# EAGLE design PQ60 Radio FV1 (EAGLE 7.4.0)
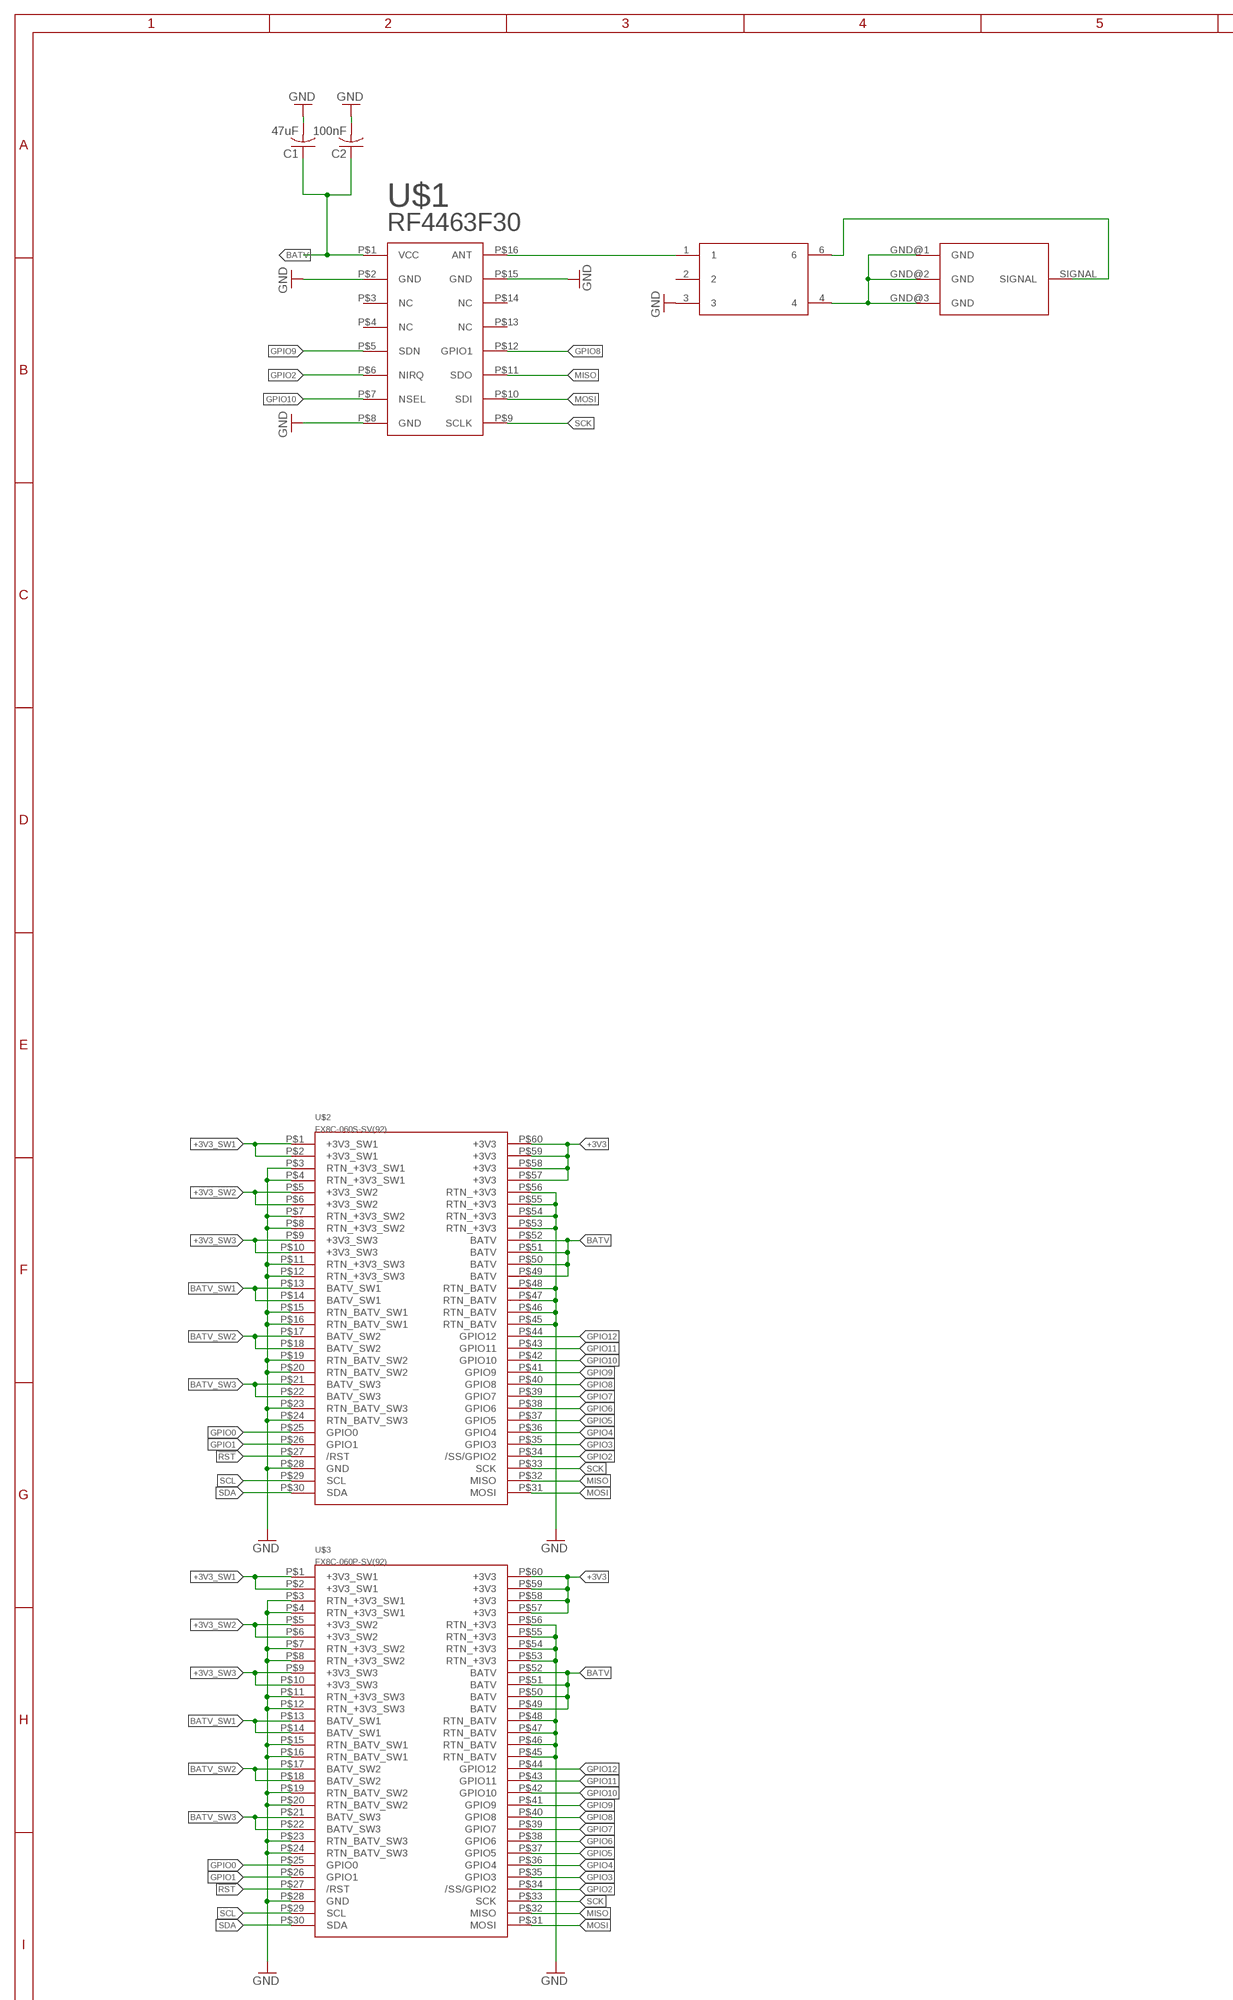
[diagram p0: schematic, sheet 1, part 1 of 2]
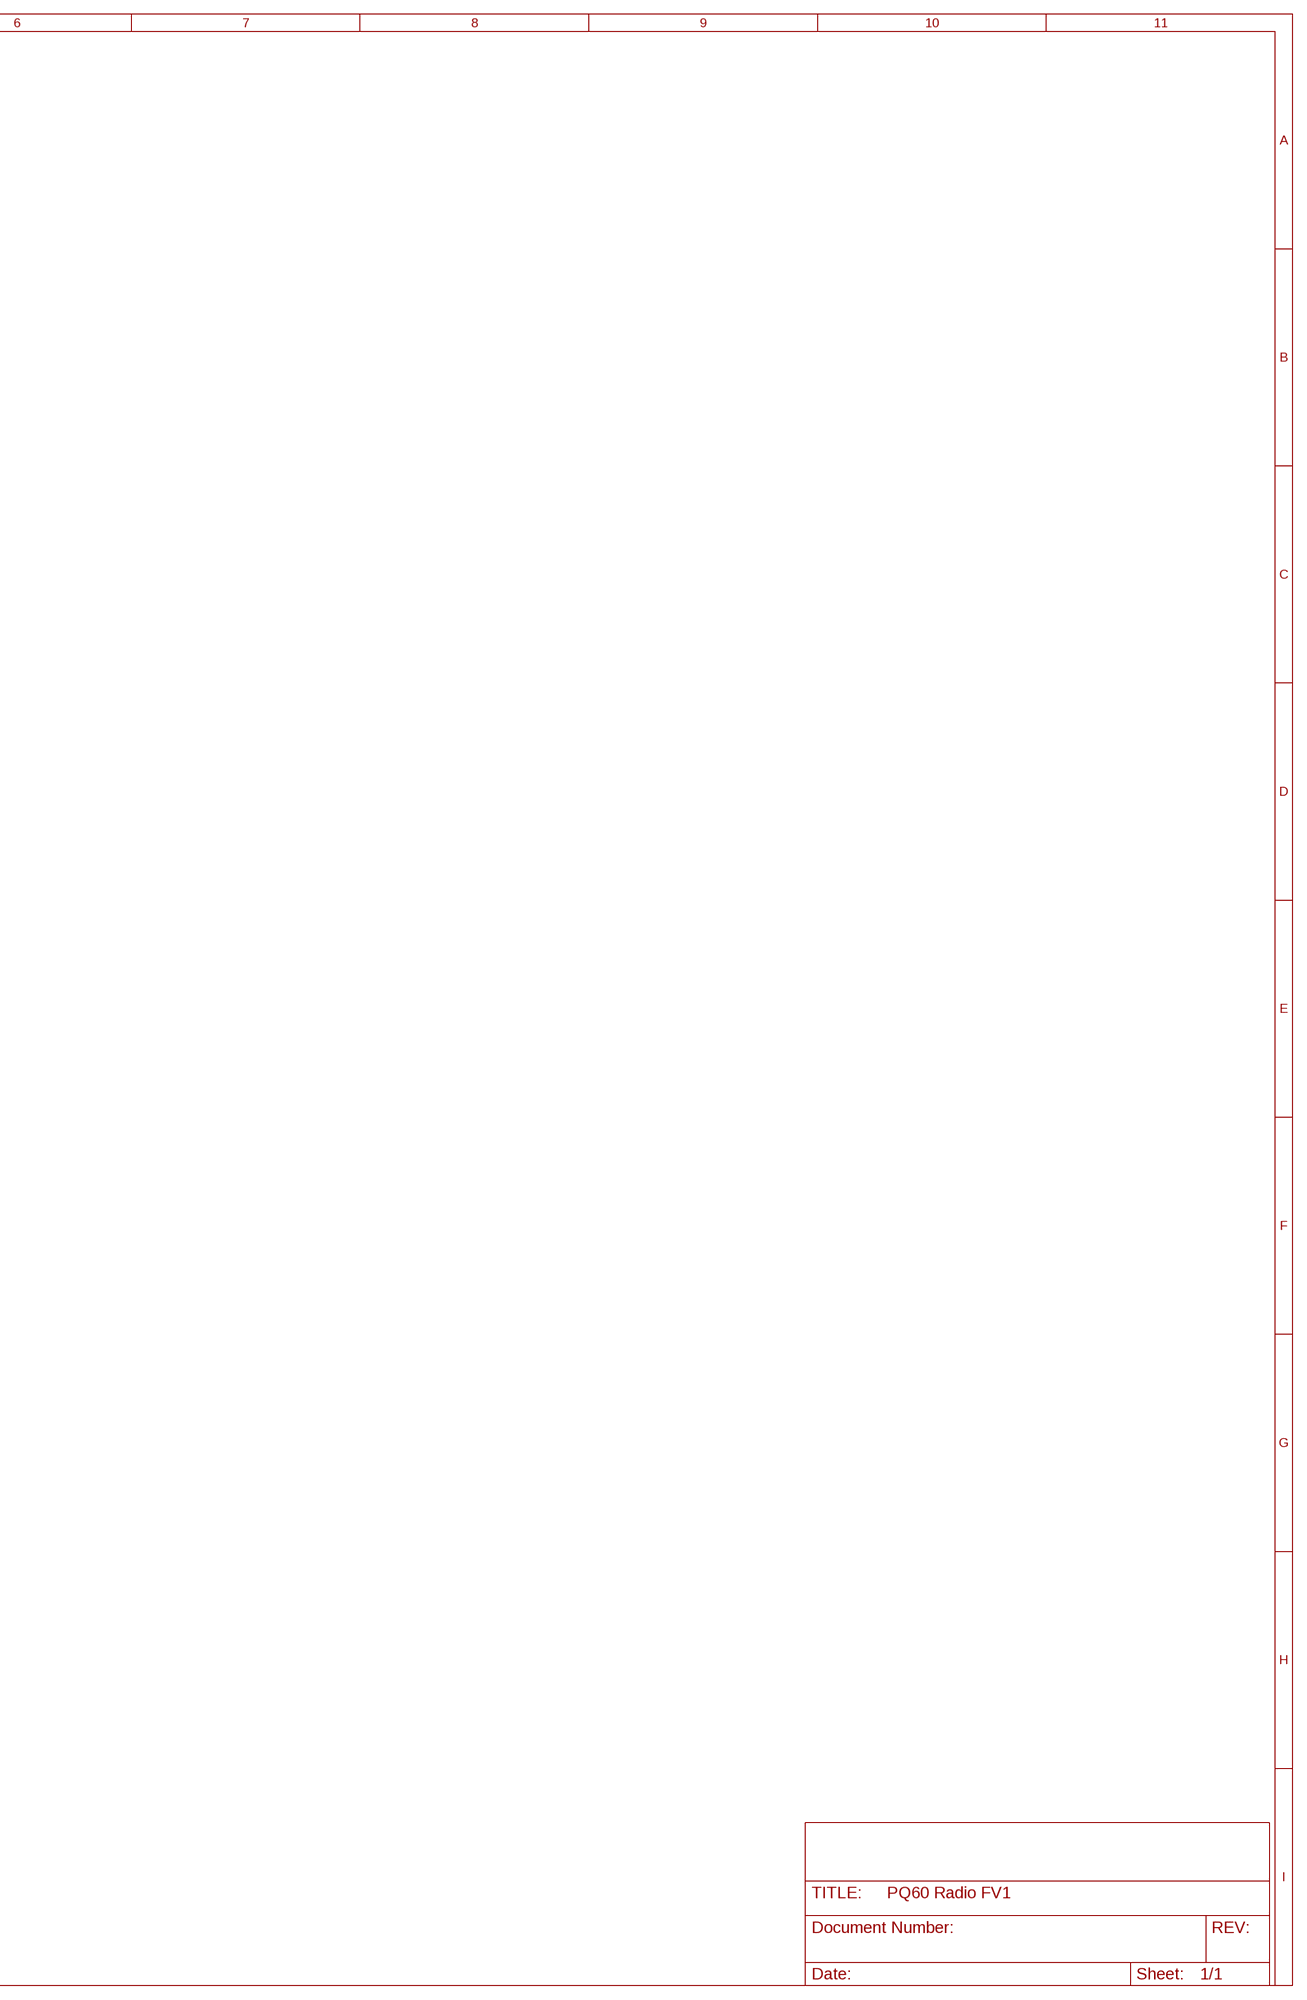
[diagram p1: schematic, sheet 1, part 2 of 2]

## Parts
C1  47uF  C-USC0805  [C0805]
C2  100nF  C-USC0805  [C0805]
CX2156NL  CX2156NL  [CX2156NL]
U$1  RF4463F30  [RF4463F30]
U$2  FX8C-060S-SV(92)  [FX8C-060S-SV(92)]
U$3  FX8C-060P-SV(92)  [FX8C-060P-SV(92)]
U$4  MICRO-SMA  [MICRO-SMA]

## Nets
!RST: U$2.P$27(/RST) U$3.P$27(/RST)
+3V3: U$2.P$57(+3V3) U$2.P$58(+3V3) U$2.P$59(+3V3) U$2.P$60(+3V3) U$3.P$57(+3V3) U$3.P$58(+3V3) U$3.P$59(+3V3) U$3.P$60(+3V3)
+3V3_SW1: U$2.P$1(+3V3_SW1) U$2.P$2(+3V3_SW1) U$3.P$1(+3V3_SW1) U$3.P$2(+3V3_SW1)
+3V3_SW2: U$2.P$5(+3V3_SW2) U$2.P$6(+3V3_SW2) U$3.P$5(+3V3_SW2) U$3.P$6(+3V3_SW2)
+3V3_SW3: U$2.P$9(+3V3_SW3) U$2.P$10(+3V3_SW3) U$3.P$9(+3V3_SW3) U$3.P$10(+3V3_SW3)
BATV: C1.1 C2.1 U$1.P$1(VCC) U$2.P$49(BATV) U$2.P$50(BATV) U$2.P$51(BATV) U$2.P$52(BATV) U$3.P$49(BATV) U$3.P$50(BATV) U$3.P$51(BATV) U$3.P$52(BATV)
BATV_SW1: U$2.P$13(BATV_SW1) U$2.P$14(BATV_SW1) U$3.P$13(BATV_SW1) U$3.P$14(BATV_SW1)
BATV_SW2: U$2.P$17(BATV_SW2) U$2.P$18(BATV_SW2) U$3.P$17(BATV_SW2) U$3.P$18(BATV_SW2)
BATV_SW3: U$2.P$21(BATV_SW3) U$2.P$22(BATV_SW3) U$3.P$21(BATV_SW3) U$3.P$22(BATV_SW3)
GND: C1.2 C2.2 CX2156NL.3 U$1.P$2(GND) U$1.P$8(GND) U$1.P$15(GND) U$2.P$3(RTN_+3V3_SW1) U$2.P$4(RTN_+3V3_SW1) U$2.P$7(RTN_+3V3_SW2) U$2.P$8(RTN_+3V3_SW2) U$2.P$11(RTN_+3V3_SW3) U$2.P$12(RTN_+3V3_SW3) U$2.P$15(RTN_BATV_SW1) U$2.P$16(RTN_BATV_SW1) U$2.P$19(RTN_BATV_SW2) U$2.P$20(RTN_BATV_SW2) U$2.P$23(RTN_BATV_SW3) U$2.P$24(RTN_BATV_SW3) U$2.P$28(GND) U$2.P$45(RTN_BATV) U$2.P$46(RTN_BATV) U$2.P$47(RTN_BATV) U$2.P$48(RTN_BATV) U$2.P$53(RTN_+3V3) U$2.P$54(RTN_+3V3) U$2.P$55(RTN_+3V3) U$2.P$56(RTN_+3V3) U$3.P$3(RTN_+3V3_SW1) U$3.P$4(RTN_+3V3_SW1) U$3.P$7(RTN_+3V3_SW2) U$3.P$8(RTN_+3V3_SW2) U$3.P$11(RTN_+3V3_SW3) U$3.P$12(RTN_+3V3_SW3) U$3.P$15(RTN_BATV_SW1) U$3.P$16(RTN_BATV_SW1) U$3.P$19(RTN_BATV_SW2) U$3.P$20(RTN_BATV_SW2) U$3.P$23(RTN_BATV_SW3) U$3.P$24(RTN_BATV_SW3) U$3.P$28(GND) U$3.P$45(RTN_BATV) U$3.P$46(RTN_BATV) U$3.P$47(RTN_BATV) U$3.P$48(RTN_BATV) U$3.P$53(RTN_+3V3) U$3.P$54(RTN_+3V3) U$3.P$55(RTN_+3V3) U$3.P$56(RTN_+3V3)
GPIO0: U$2.P$25(GPIO0) U$3.P$25(GPIO0)
GPIO1: U$2.P$26(GPIO1) U$3.P$26(GPIO1)
GPIO2: U$1.P$6(NIRQ) U$2.P$34(/SS/GPIO2) U$3.P$34(/SS/GPIO2)
GPIO3: U$2.P$35(GPIO3) U$3.P$35(GPIO3)
GPIO4: U$2.P$36(GPIO4) U$3.P$36(GPIO4)
GPIO5: U$2.P$37(GPIO5) U$3.P$37(GPIO5)
GPIO6: U$2.P$38(GPIO6) U$3.P$38(GPIO6)
GPIO7: U$2.P$39(GPIO7) U$3.P$39(GPIO7)
GPIO8: U$1.P$12(GPIO1) U$2.P$40(GPIO8) U$3.P$40(GPIO8)
GPIO9: U$1.P$5(SDN) U$2.P$41(GPIO9) U$3.P$41(GPIO9)
GPIO10: U$1.P$7(NSEL) U$2.P$42(GPIO10) U$3.P$42(GPIO10)
GPIO11: U$2.P$43(GPIO11) U$3.P$43(GPIO11)
GPIO12: U$2.P$44(GPIO12) U$3.P$44(GPIO12)
MISO: U$1.P$11(SDO) U$2.P$32(MISO) U$3.P$32(MISO)
MOSI: U$1.P$10(SDI) U$2.P$31(MOSI) U$3.P$31(MOSI)
N$1: CX2156NL.1 U$1.P$16(ANT)
N$2: CX2156NL.6 U$4.SIGNAL
N$3: CX2156NL.4 U$4.GND@1(GND) U$4.GND@2(GND) U$4.GND@3(GND)
SCK: U$1.P$9(SCLK) U$2.P$33(SCK) U$3.P$33(SCK)
SCL: U$2.P$29(SCL) U$3.P$29(SCL)
SDA: U$2.P$30(SDA) U$3.P$30(SDA)
Unconnected: CX2156NL.2 U$1.P$3(NC) U$1.P$4(NC) U$1.P$13(NC) U$1.P$14(NC)

## Library data of the parts
C1 C2 = adafruit:C-US: CAPACITOR, American symbol
CX2156NL = CX2156NL:CX2156NL
U$1 = Radio EV1:RF4463F30: Radio
U$2 = PQ60:FX8C-060S-SV(92)
U$3 = PQ60:FX8C-060P-SV(92)
U$4 = Micro-sma:MICRO-SMA

## Net classes
0 default: clearance 0.205 mm

## Board
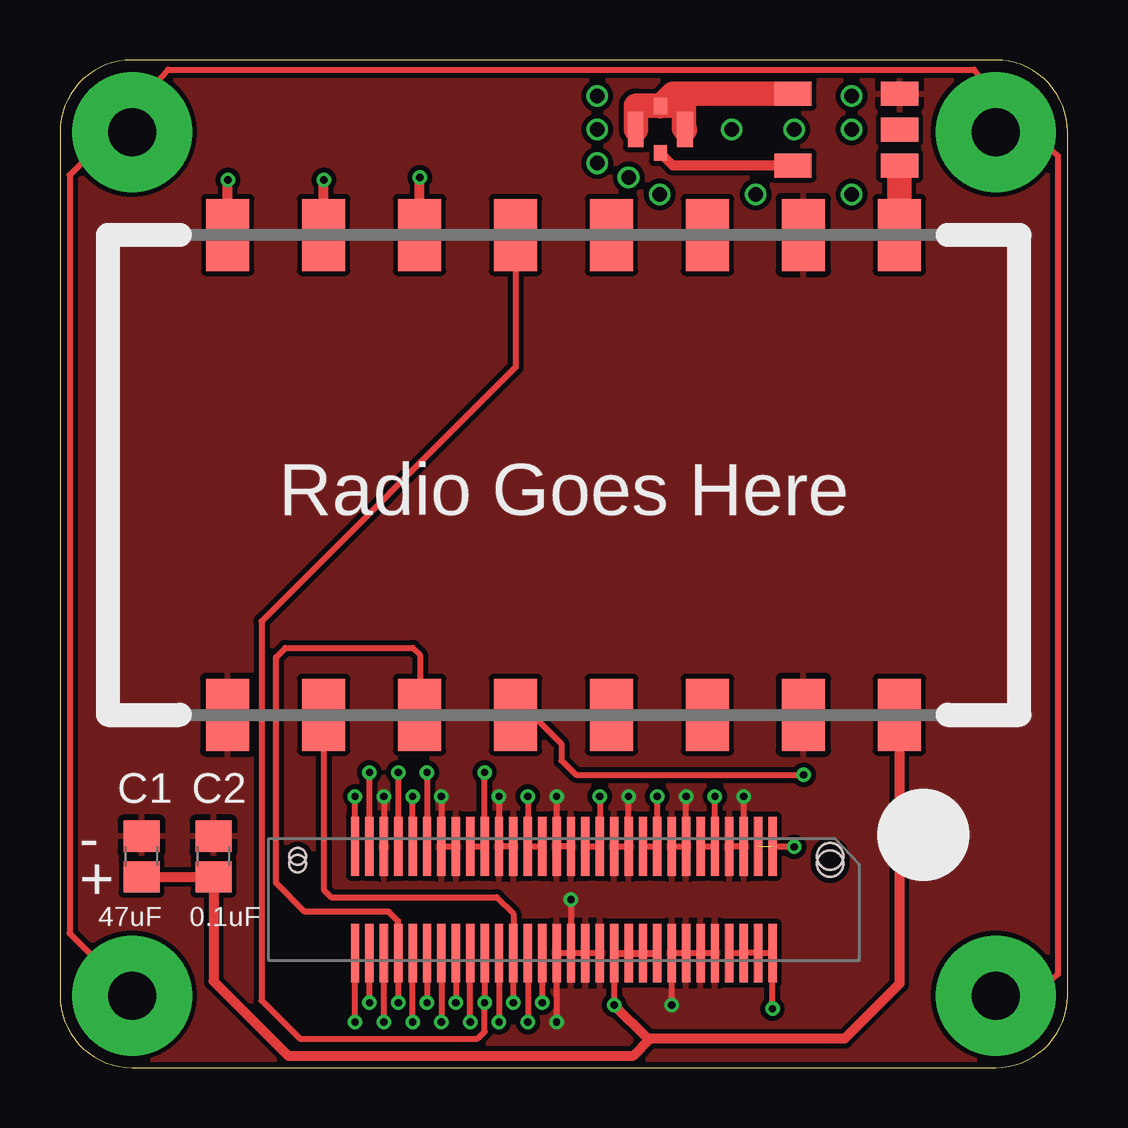
[diagram p2: board, top side]
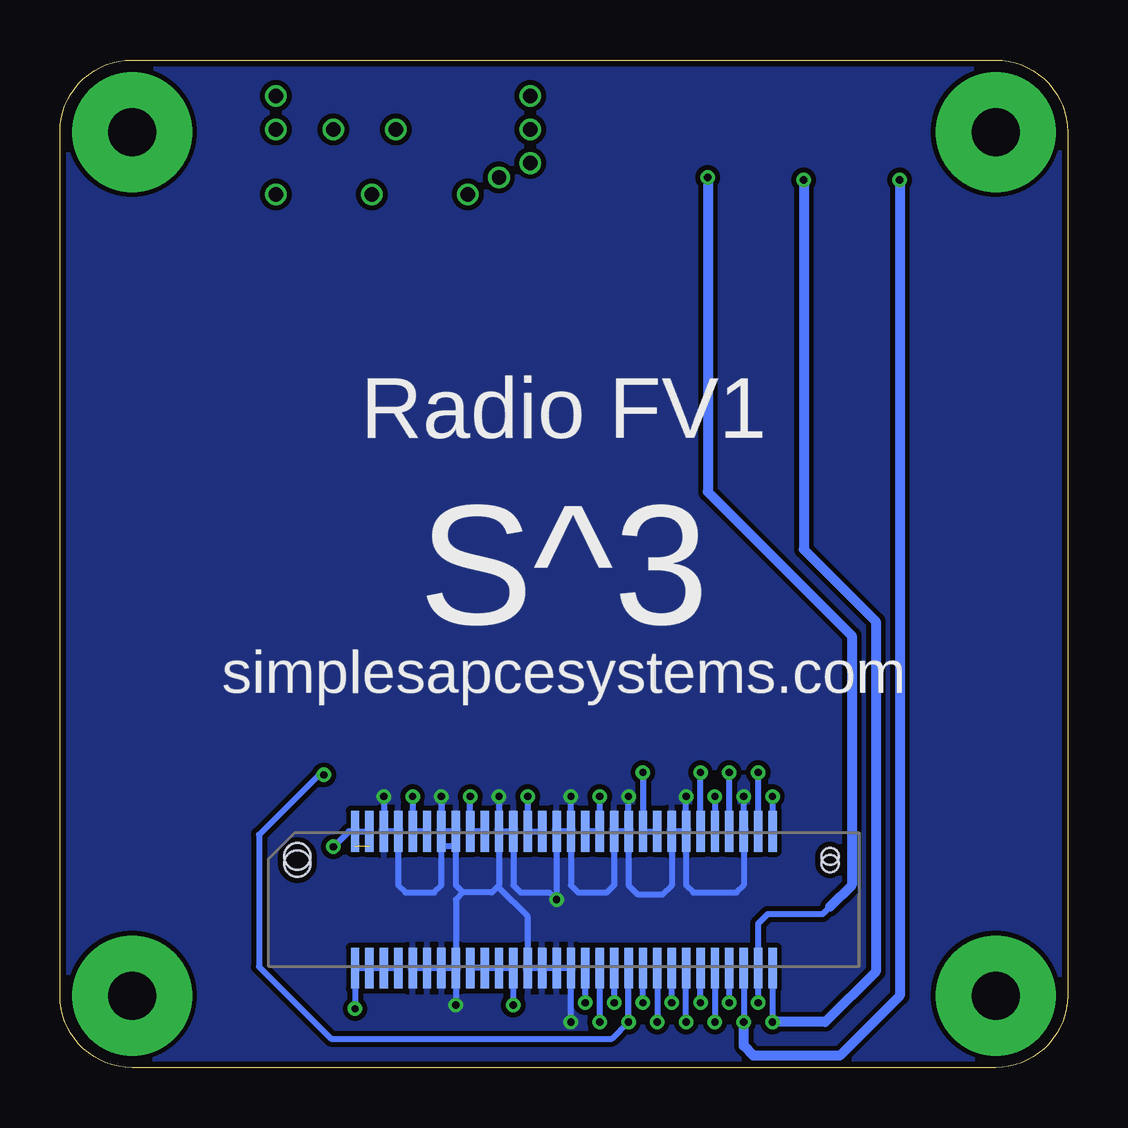
[diagram p3: board, bottom side, seen from below]

Size 42 x 42 mm. Coordinates in mm from the lower left corner, seen from the top.
Outline: 42,3 42,39 arc90 39,42 3,42 arc90 0,39 0,3 arc90 3,0 39,0 arc90 42,3
Copper layers (1*16): Top 0.035mm / dielectric 1.5mm / Bottom 0.035mm
Design rules "SeeedStudio_2layer_DRU_no_angle_20140221": minimum track width 6mil, minimum drill 12mil, track to track 6mil, track to pad 6mil, pad to pad 6mil, via to via 6mil, smd to smd 0mil, copper to edge 10mil, drill to drill 10mil, minimum pad ring 10mil, minimum via ring 6mil, stop-mask expansion 2mil, vias tented up to drill 100mil, thermal gap 10mil

### Footprints (pad centres in the part's own frame; a part is rotated, then mirrored left to right if it is on the bottom)
C0805 = smd 1.3 x 1.5: 1 -0.85,0; 2 0.85,0
CX2156NL = smd 1 x 1.55: 1 0,0; 2 1.5,0; 3 3,0; 4 3,4.45; 6 0,4.45
RF4463F30 = smd 1.8 x 3: P$1 33,-20; P$2 29,-20; P$3 25,-20; P$4 21,-20; P$5 17,-20; P$6 13,-20; P$7 9,-20; P$8 5,-20; P$9 5,0; P$10 9,0; P$11 13,0; P$12 17,0; P$13 21,0; P$14 25,0; P$15 29,0; P$16 33,0
FX8C-060S-SV(92) = smd 0.35 x 1.7: P$1 -8.7,2.85; P$2 -8.1,2.85; P$3 -7.5,2.85; P$4 -6.9,2.85; P$5 -6.3,2.85; P$6 -5.7,2.85; P$7 -5.1,2.85; P$8 -4.5,2.85; P$9 -3.9,2.85; P$10 -3.3,2.85; P$11 -2.7,2.85; P$12 -2.1,2.85; P$13 -1.5,2.85; P$14 -0.9,2.85; P$15 -0.3,2.85; P$16 0.3,2.85; P$17 0.9,2.85; P$18 1.5,2.85; P$19 2.1,2.85; P$20 2.7,2.85; P$21 3.3,2.85; P$22 3.9,2.85; P$23 4.5,2.85; P$24 5.1,2.85; P$25 5.7,2.85; P$26 6.3,2.85; P$27 6.9,2.85; P$28 7.5,2.85; P$29 8.1,2.85; P$30 8.7,2.85; P$31 8.7,-2.85; P$32 8.1,-2.85; P$33 7.5,-2.85; P$34 6.9,-2.85; P$35 6.3,-2.85; P$36 5.7,-2.85; P$37 5.1,-2.85; P$38 4.5,-2.85; P$39 3.9,-2.85; P$40 3.3,-2.85; P$41 2.7,-2.85; P$42 2.1,-2.85; P$43 1.5,-2.85; P$44 0.9,-2.85; P$45 0.3,-2.85; P$46 -0.3,-2.85; P$47 -0.9,-2.85; P$48 -1.5,-2.85; P$49 -2.1,-2.85; P$50 -2.7,-2.85; P$51 -3.3,-2.85; P$52 -3.9,-2.85; P$53 -4.5,-2.85; P$54 -5.1,-2.85; P$55 -5.7,-2.85; P$56 -6.3,-2.85; P$57 -6.9,-2.85; P$58 -7.5,-2.85; P$59 -8.1,-2.85; P$60 -8.7,-2.85 | hole 1.1: -11.1,1.8 | hole 0.7: 11.1,1.8
FX8C-060P-SV(92) = smd 0.35 x 2.45: P$1 -8.7,-2.225; P$2 -8.1,-2.225; P$3 -7.5,-2.225; P$4 -6.9,-2.225; P$5 -6.3,-2.225; P$6 -5.7,-2.225; P$7 -5.1,-2.225; P$8 -4.5,-2.225; P$9 -3.9,-2.225; P$10 -3.3,-2.225; P$11 -2.7,-2.225; P$12 -2.1,-2.225; P$13 -1.5,-2.225; P$14 -0.9,-2.225; P$15 -0.3,-2.225; P$16 0.3,-2.225; P$17 0.9,-2.225; P$18 1.5,-2.225; P$19 2.1,-2.225; P$20 2.7,-2.225; P$21 3.3,-2.225; P$22 3.9,-2.225; P$23 4.5,-2.225; P$24 5.1,-2.225; P$25 5.7,-2.225; P$26 6.3,-2.225; P$27 6.9,-2.225; P$28 7.5,-2.225; P$29 8.1,-2.225; P$30 8.7,-2.225; P$31 8.7,2.225; P$32 8.1,2.225; P$33 7.5,2.225; P$34 6.9,2.225; P$35 6.3,2.225; P$36 5.7,2.225; P$37 5.1,2.225; P$38 4.5,2.225; P$39 3.9,2.225; P$40 3.3,2.225; P$41 2.7,2.225; P$42 2.1,2.225; P$43 1.5,2.225; P$44 0.9,2.225; P$45 0.3,2.225; P$46 -0.3,2.225; P$47 -0.9,2.225; P$48 -1.5,2.225; P$49 -2.1,2.225; P$50 -2.7,2.225; P$51 -3.3,2.225; P$52 -3.9,2.225; P$53 -4.5,2.225; P$54 -5.1,2.225; P$55 -5.7,2.225; P$56 -6.3,2.225; P$57 -6.9,2.225; P$58 -7.5,2.225; P$59 -8.1,2.225; P$60 -8.7,2.225 | hole 1.1: -11.1,-1.5 | hole 0.7: 11.1,-1.5
MICRO-SMA = smd 0.65 x 1.45: GND@1 0,0; GND@3 2.05,0 | smd 0.55 x 0.65: GND@2 1.025,0.975; SIGNAL 1.025,-0.975

### Placement (x,y rotation side)
C1  3.4,8.8 90 top
C2  6.4,8.8 90 top
CX2156NL  35,37.6 90 top
U$1  1.99,34.7 0 top
U$2  21,7 0 bottom
U$3  21,7 180 top
U$4  24,39.1 0 top

### Tracks (layer width: path | path; a pad name or v marks a point on that pad's centre or on a via)
!RST  (via drill 0.3)
  Top 0.254: v14.1,12.3 U$3.P$27
  Bottom 0.254: U$2.P$27 v14.1,12.3
+3V3  (via drill 0.3)
  Top 0.254: U$3.P$57 U$3.P$58 U$3.P$59 U$3.P$60 v29.7,2.45
  Bottom 0.254: U$2.P$60 U$2.P$59 U$2.P$58 U$2.P$57 | U$2.P$60 U$3.P$60 | U$2.P$60 v29.7,2.45
+3V3_SW1  (via drill 0.3)  (1 unrouted)
  Top 0.254: v30.6,9.2 29.73,9.2 U$3.P$1
  Bottom 0.254: U$2.P$2 U$2.P$1 29.95,9.85 v30.6,9.2
+3V3_SW2  (via drill 0.3)
  Top 0.254: U$3.P$6 U$3.P$5 v27.3,11.3
  Bottom 0.254: U$2.P$6 U$2.P$5 v27.3,11.3
+3V3_SW3  (via drill 0.3)
  Top 0.254: U$3.P$10 U$3.P$9 v24.9,11.3
  Bottom 0.254: U$2.P$10 U$2.P$9 | 24.9,9.1 U$2.P$9 | U$2.P$9 v24.9,11.3
BATV  (via drill 0.3)
  Top 0.254: U$3.P$49 U$3.P$50 U$3.P$51 U$3.P$52 24.85,4.72 23.1,4.72 v23.1,2.6
  Top 0.406: C1.1 C2.1 6.4,3.6 9.5,0.5 23.9,0.5 24.6,1.2 | U$1.P$1 34.99,3.49 32.7,1.2 24.6,1.2 | 24.6,1.2 24.5,1.2 v23.1,2.6
  Bottom 0.254: U$2.P$52 U$2.P$51 U$2.P$50 U$2.P$49 | v23.1,2.6 U$2.P$49 | 23.1,4.7 U$2.P$49
BATV_SW1  (via drill 0.3)
  Top 0.254: U$3.P$14 U$3.P$13 v22.5,11.3
  Bottom 0.254: U$2.P$14 U$2.P$13 v22.5,11.3
BATV_SW2  (via drill 0.3)
  Top 0.254: U$3.P$17 U$3.P$18 v19.5,11.3
  Bottom 0.254: U$2.P$17 U$2.P$18 v19.5,11.3
BATV_SW3  (via drill 0.3)
  Top 0.254: U$3.P$22 U$3.P$21 v17.7,12.3
  Bottom 0.254: U$2.P$22 U$2.P$21 v17.7,12.3
CHASSIS_GND  (via drill 2 pad 5)
  Top 0.254: v3,3 0.4,5.6 0.4,37.2 2.2,39 v3,39 3,40 4.5,41.6 38.1,41.6 39,40.6 v39,39 40.5,39 41.6,38 41.6,3.9 40.6,3 v39,3
GND  (via drill 0.3)
  Top 0.254: U$3.P$46 U$3.P$45 v20.7,1.9 | U$3.P$46 U$3.P$47 U$3.P$48 | U$3.P$56 U$3.P$55 U$3.P$54 U$3.P$53 v25.5,2.6 | v21.3,7 U$3.P$46 | v13.5,11.3 U$3.P$28 | U$3.P$23 U$3.P$24 v15.9,11.3 | U$3.P$19 U$3.P$20 v18.3,11.3 | U$3.P$15 U$3.P$16 v20.7,11.3 | U$3.P$12 U$3.P$11 v23.7,11.3 | U$3.P$8 U$3.P$7 v26.1,11.3 | U$3.P$4 U$3.P$3 v28.5,11.3
  Bottom 0.254: U$2.P$56 U$2.P$55 U$2.P$54 U$2.P$53 | v20.7,1.9 U$2.P$45 U$2.P$46 U$2.P$47 U$2.P$48 22.5,6.3 23.7,7.5 23.7,7.6 | U$2.P$53 v25.5,2.6 | U$2.P$24 15.9,7.6 15.6,7.3 13.8,7.3 13.5,7.6 U$2.P$28 v13.5,11.3 | U$2.P$24 U$2.P$23 16.5,7.6 16.9,7.2 17.9,7.2 18.3,7.6 U$2.P$20 | U$2.P$20 U$2.P$19 18.9,7.6 19.2,7.3 20.4,7.3 20.7,7.6 U$2.P$16 | U$2.P$16 U$2.P$15 v21.3,7 21.6,7.3 22.8,7.3 23.1,7.6 U$2.P$12 U$2.P$11 v23.7,11.3 | U$2.P$24 v15.9,11.3 | U$2.P$20 v18.3,11.3 | U$2.P$16 v20.7,11.3 | U$2.P$8 U$2.P$7 v26.1,11.3 U$3.P$7 | 23.7,9.2 23.7,7.6 | 23.7,7.6 24,7.3 25.2,7.3 | 25.2,7.3 25.5,7.6 U$3.P$8 U$3.P$7 | 25.2,7.3 25.5,7 U$2.P$53 | U$3.P$7 26.1,7.6 26.4,7.3 27.6,7.3 27.9,7.6 U$2.P$4 U$2.P$3 v28.5,11.3
  pour Bottom: 33.8,42 3.2,42 arc90 0,38.8 0,3.2 arc90 3.2,0 38.8,0 arc90 42.1,3.3 42.1,38.7 arc90 38.8,42 35.6,42
  pour Top: 34.1,42 3.3,42 arc90 0,38.7 0,3.3 arc90 3.3,0 38.8,0 arc90 42,3.2 42,39 arc90 39,42 34.6,42
GPIO0  (via drill 0.3)
  Top 0.254: v15.3,12.3 U$3.P$25
  Bottom 0.254: U$2.P$25 v15.3,12.3
GPIO1  (via drill 0.3)
  Top 0.254: U$3.P$26 v14.7,11.3
  Bottom 0.254: v14.7,11.3 U$2.P$26
GPIO2  (via drill 0.3)
  Top 0.254: v14.1,2.7 U$3.P$34 14.1,6.1 13.7,6.5 10.2,6.5 9,7.7 9,17.1 9.4,17.5 14.7,17.5 15,17.2 U$1.P$6
  Bottom 0.254: v14.1,2.7 U$2.P$34
GPIO3  (via drill 0.3)
  Top 0.254: v14.7,1.9 U$3.P$35
  Bottom 0.254: U$2.P$35 v14.7,1.9
GPIO4  (via drill 0.3)
  Top 0.254: U$3.P$36 v15.3,2.7
  Bottom 0.254: v15.3,2.7 U$2.P$36
GPIO5  (via drill 0.3)
  Top 0.254: U$3.P$37 v15.9,1.9
  Bottom 0.254: v15.9,1.9 U$2.P$37 | U$2.P$37 15.9,4.7 15.85,4.75 15.85,4.2 U$2.P$37
GPIO6  (via drill 0.3)
  Top 0.254: U$3.P$38 v16.5,2.7
  Bottom 0.254: v16.5,2.7 U$2.P$38
GPIO7  (via drill 0.3)
  Top 0.254: v17.1,1.9 U$3.P$39
  Bottom 0.254: U$2.P$39 v17.1,1.9
GPIO8  (via drill 0.3)
  Top 0.254: U$3.P$40 v17.7,2.7 17.7,1.5 17.4,1.2 10,1.2 8.4,2.8 8.4,18.6 18.99,29.19 U$1.P$12
  Bottom 0.254: v17.7,2.7 U$2.P$40 | U$2.P$40 17.7,4.8 17.65,4.85 17.65,4.2 U$2.P$40
GPIO9  (via drill 0.3)
  Top 0.254: U$3.P$41 v18.3,1.9 | U$1.P$5 19.7,14.7 20.9,13.5 20.9,12.8 21.5,12.2 v31,12.2
  Bottom 0.254: U$2.P$41 v18.3,1.9 19,1.2 30.7,1.2 33.7,4.2 33.7,9.7 31.2,12.2 v31,12.2
GPIO10  (via drill 0.3)
  Top 0.254: v18.9,2.7 U$3.P$42 18.9,6.4 18.2,7.1 11.3,7.1 10.99,7.41 U$1.P$7
  Bottom 0.254: U$2.P$42 v18.9,2.7
GPIO11  (via drill 0.3)
  Top 0.254: U$3.P$43 v19.5,1.9
  Bottom 0.254: v19.5,1.9 U$2.P$43
GPIO12  (via drill 0.3)
  Top 0.254: U$3.P$44 v20.1,2.7
  Bottom 0.254: v20.1,2.7 U$2.P$44
MISO  (via drill 0.3)
  Top 0.254: v12.9,2.7 U$3.P$32
  Top 0.406: U$1.P$11 v14.99,37.09 v15,37.1
  Bottom 0.254: v12.9,2.7 U$2.P$32 12.9,6 12.5,6.4 10.2,6.4 9.9,6.7
  Bottom 0.406: v15,37.1 15,24 9,18 9,7.6 9.9,6.7
MOSI  (via drill 0.3)
  Top 0.254: v12.3,1.9 U$3.P$31
  Top 0.406: U$1.P$10 v10.99,36.99 v11,37
  Bottom 0.254: U$2.P$31 v12.3,1.9
  Bottom 0.406: v11,37 11,21.6 8,18.6 8,4 10.1,1.9 v12.3,1.9
N$1
  Top 1.016: U$1.P$16 CX2156NL.1
N$2
  Top 0.406: CX2156NL.6 25.55,37.6 U$4.SIGNAL
N$3
  Top 1.016: U$4.GND@1 24,40.1 25.05,40.1 | U$4.GND@3 26,39.15 26,40.1 25.05,40.1 | CX2156NL.4 25.55,40.6 U$4.GND@2 25.05,40.1
N$4  (via drill 0.6)
  other vias: 22.4,40.5
N$5  (via drill 0.6)
  other vias: 22.4,39.1
N$6  (via drill 0.6)
  other vias: 22.4,37.7
N$7  (via drill 0.6)
  other vias: 23.7,37.1
N$8  (via drill 0.6)
  other vias: 25,36.4
N$9  (via drill 0.6)
  other vias: 29,36.4
N$10  (via drill 0.6)
  other vias: 28,39.1
N$11  (via drill 0.6)
  other vias: 30.6,39.1
N$12  (via drill 0.6)
  other vias: 33,40.5
N$13  (via drill 0.6)
  other vias: 33,39.1
N$14  (via drill 0.6)
  other vias: 33,36.4
SCK  (via drill 0.3)
  Top 0.254: v13.5,1.9 U$3.P$33
  Top 0.406: U$1.P$9 v6.99,36.99 v7,37
  Bottom 0.254: U$2.P$33 v13.5,1.9
  Bottom 0.406: v7,37 7,3 9.5,0.5 13.1,0.5 13.5,0.9 v13.5,1.9
SCL  (via drill 0.3)
  Top 0.254: U$3.P$29 v12.9,12.3
  Bottom 0.254: v12.9,12.3 U$2.P$29
SDA  (via drill 0.3)
  Top 0.254: U$3.P$30 v12.3,11.3
  Bottom 0.254: v12.3,11.3 U$2.P$30

### Text on the board
tPlace: Radio Goes Here | - | + | 47uF | 0.1uF
bPlace: Radio FV1 | S^3 | simplesapcesystems.com
tStop: S^3 | Radio FV1